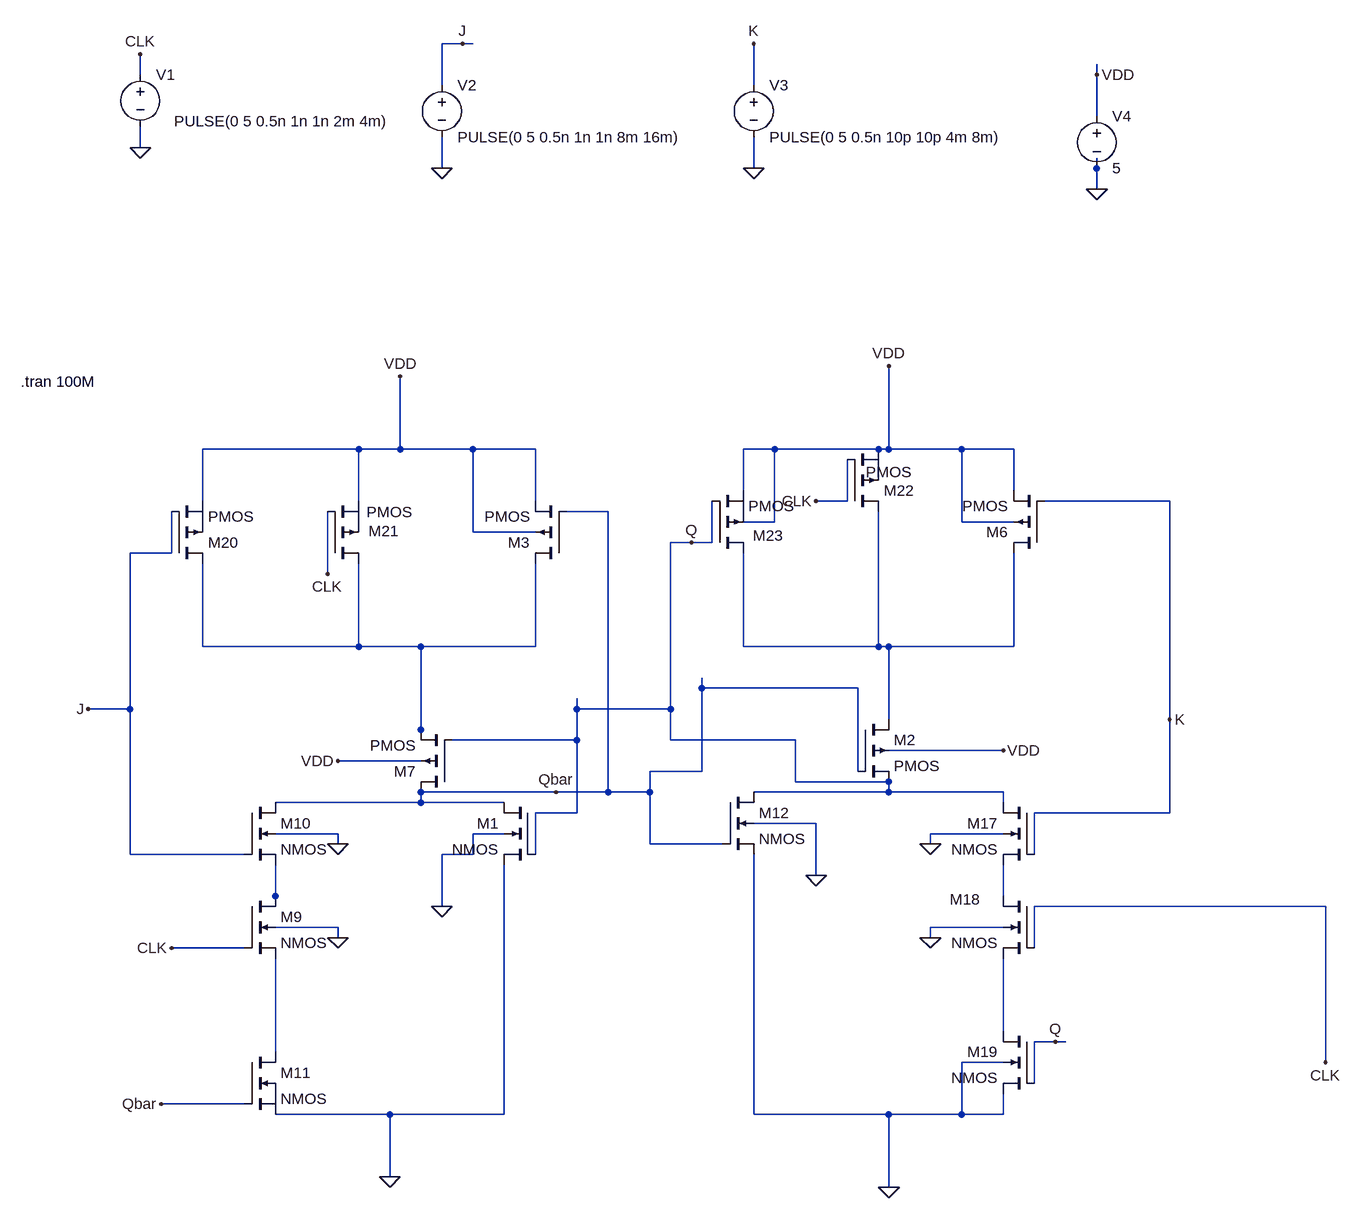
[diagram p0: schematic CIRCUITOFINAL.asc]
CIRCUITOFINAL.asc, the LTspice schematic file:
Version 4
SHEET 1 2232 1560
WIRE 720 -336 688 -336
WIRE 736 -336 720 -336
WIRE 224 -288 224 -320
WIRE 1696 -288 1696 -304
WIRE 688 -272 688 -336
WIRE 1168 -272 1168 -336
WIRE 1696 -224 1696 -288
WIRE 224 -176 224 -208
WIRE 688 -144 688 -192
WIRE 1168 -144 1168 -192
WIRE 1696 -144 1696 -160
WIRE 1696 -112 1696 -144
WIRE 560 288 320 288
WIRE 624 288 624 176
WIRE 624 288 560 288
WIRE 736 288 624 288
WIRE 832 288 736 288
WIRE 1200 288 1152 288
WIRE 1360 288 1200 288
WIRE 1376 288 1376 160
WIRE 1376 288 1360 288
WIRE 1488 288 1376 288
WIRE 1568 288 1488 288
WIRE 1152 352 1152 288
WIRE 1568 352 1568 288
WIRE 320 368 320 288
WIRE 560 368 560 288
WIRE 832 368 832 288
WIRE 1312 368 1312 304
WIRE 1312 368 1264 368
WIRE 1808 368 1616 368
WIRE 944 384 880 384
WIRE 1200 400 1200 288
WIRE 1200 400 1152 400
WIRE 1488 400 1488 288
WIRE 1568 400 1488 400
WIRE 736 416 736 288
WIRE 832 416 736 416
WIRE 1072 432 1040 432
WIRE 1104 432 1104 368
WIRE 1104 432 1072 432
WIRE 272 448 272 384
WIRE 272 448 208 448
WIRE 512 480 512 384
WIRE 320 592 320 464
WIRE 560 592 560 464
WIRE 560 592 320 592
WIRE 656 592 560 592
WIRE 832 592 832 464
WIRE 832 592 656 592
WIRE 1152 592 1152 448
WIRE 1360 592 1360 384
WIRE 1360 592 1152 592
WIRE 1376 592 1360 592
WIRE 1568 592 1568 448
WIRE 1568 592 1376 592
WIRE 1088 656 1088 640
WIRE 1328 656 1088 656
WIRE 208 688 208 448
WIRE 208 688 144 688
WIRE 896 688 896 672
WIRE 1040 688 1040 432
WIRE 1040 688 896 688
WIRE 1376 704 1376 592
WIRE 1808 704 1808 368
WIRE 656 720 656 592
WIRE 656 736 656 720
WIRE 896 736 896 688
WIRE 896 736 704 736
WIRE 1040 736 1040 688
WIRE 1232 736 1040 736
WIRE 1552 752 1376 752
WIRE 656 768 528 768
WIRE 1088 784 1088 656
WIRE 1088 784 1008 784
WIRE 1328 784 1328 656
WIRE 1232 800 1232 736
WIRE 1376 800 1232 800
WIRE 864 816 656 816
WIRE 944 816 944 384
WIRE 944 816 864 816
WIRE 1008 816 1008 784
WIRE 1008 816 944 816
WIRE 1376 816 1376 800
WIRE 1376 816 1168 816
WIRE 1552 816 1376 816
WIRE 656 832 656 816
WIRE 656 832 432 832
WIRE 784 832 656 832
WIRE 1552 832 1552 816
WIRE 896 848 896 736
WIRE 896 848 832 848
WIRE 1808 848 1808 704
WIRE 1808 848 1600 848
WIRE 1264 864 1168 864
WIRE 528 880 432 880
WIRE 784 880 736 880
WIRE 1552 880 1440 880
WIRE 528 896 528 880
WIRE 1008 896 1008 816
WIRE 1120 896 1008 896
WIRE 1440 896 1440 880
WIRE 208 912 208 688
WIRE 384 912 208 912
WIRE 736 912 736 880
WIRE 736 912 688 912
WIRE 832 912 832 848
WIRE 1600 912 1600 848
WIRE 1264 944 1264 864
WIRE 432 976 432 928
WIRE 1552 976 1552 928
WIRE 432 992 432 976
WIRE 688 992 688 912
WIRE 2048 992 1600 992
WIRE 528 1024 432 1024
WIRE 1552 1024 1440 1024
WIRE 528 1040 528 1024
WIRE 1440 1040 1440 1024
WIRE 384 1056 272 1056
WIRE 1600 1056 1600 992
WIRE 1552 1184 1552 1072
WIRE 1632 1200 1600 1200
WIRE 1648 1200 1632 1200
WIRE 432 1216 432 1072
WIRE 1552 1232 1488 1232
WIRE 2048 1232 2048 992
WIRE 1600 1264 1600 1200
WIRE 384 1296 256 1296
WIRE 608 1312 432 1312
WIRE 784 1312 784 928
WIRE 784 1312 608 1312
WIRE 1168 1312 1168 912
WIRE 1376 1312 1168 1312
WIRE 1488 1312 1488 1232
WIRE 1488 1312 1376 1312
WIRE 1552 1312 1552 1280
WIRE 1552 1312 1488 1312
WIRE 608 1408 608 1312
WIRE 1376 1424 1376 1312
FLAG 224 -176 0
FLAG 224 -320 CLK
FLAG 688 -144 0
FLAG 1696 -112 0
FLAG 528 896 0
FLAG 528 1040 0
FLAG 608 1408 0
FLAG 1376 1424 0
FLAG 1440 1040 0
FLAG 1440 896 0
FLAG 1264 944 0
FLAG 1264 368 CLK
FLAG 272 1056 CLK
FLAG 2048 1232 CLK
FLAG 624 176 VDD
FLAG 1376 160 VDD
FLAG 144 688 J
FLAG 1072 432 Q
FLAG 256 1296 Qbar
FLAG 1552 752 VDD
FLAG 528 768 VDD
FLAG 1168 -144 0
FLAG 1696 -288 VDD
FLAG 864 816 Qbar
FLAG 688 992 0
FLAG 512 480 CLK
FLAG 720 -336 J
FLAG 1168 -336 K
FLAG 1632 1200 Q
FLAG 1808 704 K
SYMBOL voltage 224 -304 R0
WINDOW 123 0 0 Left 0
WINDOW 39 0 0 Left 0
WINDOW 3 52 87 Left 2
SYMATTR InstName V1
SYMATTR Value PULSE(0 5 0.5n 1n 1n 2m 4m)
SYMBOL voltage 688 -288 R0
WINDOW 123 0 0 Left 0
WINDOW 39 0 0 Left 0
SYMATTR InstName V2
SYMATTR Value PULSE(0 5 0.5n 1n 1n 8m 16m)
SYMBOL voltage 1168 -288 R0
WINDOW 123 0 0 Left 0
WINDOW 39 0 0 Left 0
SYMATTR InstName V3
SYMATTR Value PULSE(0 5 0.5n 10p 10p 4m 8m)
SYMBOL pmos4 880 464 R180
SYMATTR InstName M3
SYMBOL pmos4 1616 448 R180
SYMATTR InstName M6
SYMBOL pmos4 704 816 R180
SYMATTR InstName M7
SYMBOL nmos 384 1216 R0
SYMATTR InstName M11
SYMBOL nmos4 384 976 R0
SYMATTR InstName M9
SYMBOL nmos4 384 832 R0
SYMATTR InstName M10
SYMBOL nmos4 1120 816 R0
SYMATTR InstName M12
SYMBOL voltage 1696 -240 R0
WINDOW 123 0 0 Left 0
WINDOW 39 0 0 Left 0
SYMATTR InstName V4
SYMATTR Value 5
SYMBOL nmos4 1600 832 M0
SYMATTR InstName M17
SYMBOL nmos4 1600 976 M0
WINDOW 0 83 5 Left 2
SYMATTR InstName M18
SYMBOL nmos4 1600 1184 M0
SYMATTR InstName M19
SYMBOL pmos 272 464 M180
SYMATTR InstName M20
SYMBOL pmos 512 464 M180
WINDOW 0 63 50 Left 2
WINDOW 3 60 79 Left 2
SYMATTR InstName M21
SYMBOL pmos 1312 384 M180
WINDOW 3 29 61 Left 2
SYMATTR InstName M22
SYMBOL pmos 1104 448 M180
WINDOW 0 63 27 Left 2
SYMATTR InstName M23
SYMBOL nmos4 832 832 M0
SYMATTR InstName M1
SYMBOL pmos4 1328 704 R0
SYMATTR InstName M2
TEXT 40 184 Left 2 !.tran 100M

The netlist it stands for:
* CIRCUITOFINAL.asc
V1 CLK 0 PULSE(0 5 0.5n 1n 1n 2m 4m)
V2 J 0 PULSE(0 5 0.5n 1n 1n 8m 16m)
V3 K 0 PULSE(0 5 0.5n 10p 10p 4m 8m)
M3 N001 Qbar VDD VDD PMOS
M6 N002 K VDD VDD PMOS
M7 Qbar Q N001 VDD PMOS
M11 N006 Qbar 0 0 NMOS
M9 N003 CLK N006 0 NMOS
M10 Qbar J N003 0 NMOS
M12 Q Qbar 0 0 NMOS
V4 VDD 0 5
M17 Q K N004 0 NMOS
M18 N004 CLK N005 0 NMOS
M19 N005 Q 0 0 NMOS
M20 N001 J VDD VDD PMOS
M21 N001 CLK VDD VDD PMOS
M22 N002 CLK VDD VDD PMOS
M23 N002 Q VDD VDD PMOS
M1 Qbar Q 0 0 NMOS
M2 N002 Qbar Q VDD PMOS
.model NMOS NMOS
.model PMOS PMOS
.lib standard.mos
.tran 100M
.backanno
.end